# EAGLE design tritiled_v30_batt_pcb (EAGLE 8.2.2)
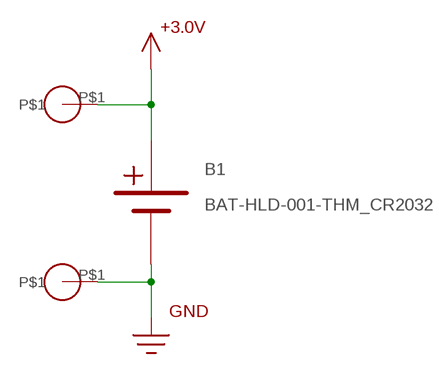
[diagram p0: schematic, sheet 1]

## Parts
B1  BAT-HLD-001-THM_CR2032  [CR2032_BAT-HLD-001-THM]
U$1  HDR_1_PIN  [HDR_1_PIN]
U$2  HDR_1_PIN  [HDR_1_PIN]

## Nets
+3.6V: B1.+V@1(+V) B1.+V@2(+V) B1.+V@3(+V) B1.+V@4(+V) U$1.P$1 ; supply symbol labelled +3.0V
GND: B1.GND(0V) U$2.P$1

## Library data of the parts
B1 = tritiled:BAT-HLD-001-THM_CR2032
U$1 U$2 = tritiled:HDR_1_PIN

## Board
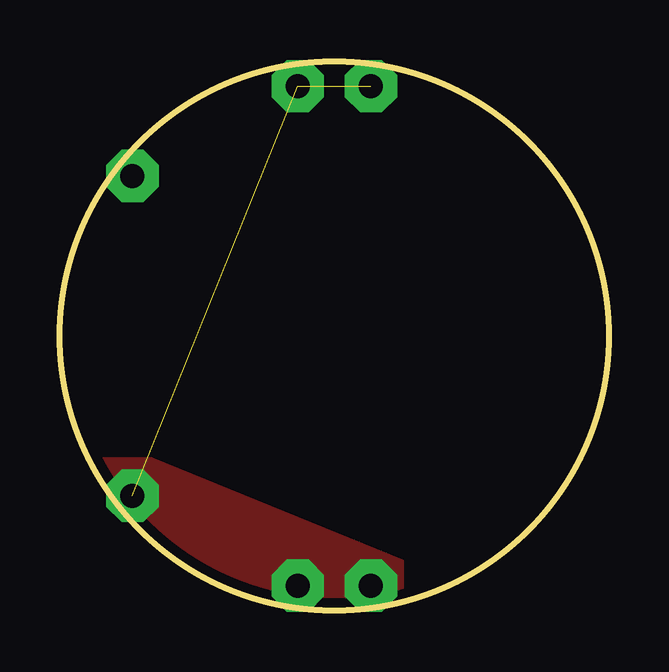
[diagram p1: board, top side]
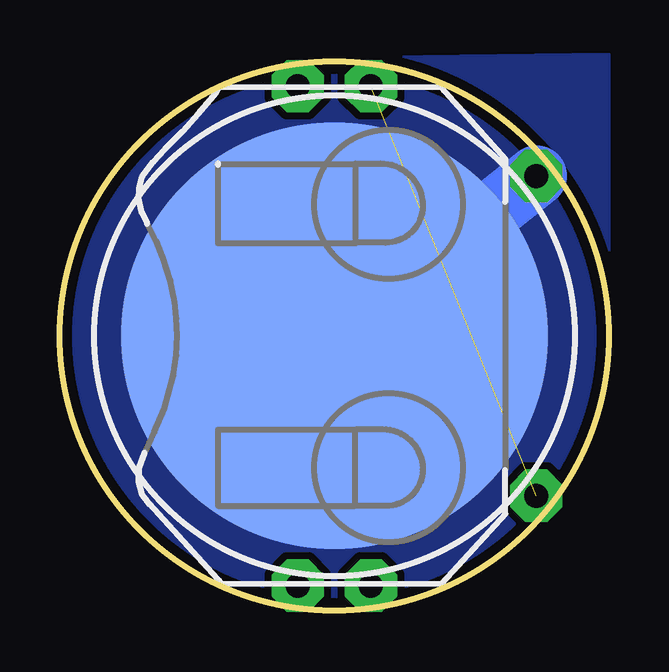
[diagram p2: board, bottom side, seen from below]

Size 22.86 x 22.86 mm. Coordinates in mm from the lower left corner, seen from the top.
Outline: circle at 11.43,11.43 radius 11.43
Copper layers (1*16): Top 0.0356mm / dielectric 1.5011mm / Bottom 0.0356mm
Design rules "LaenPCBOrder_tented_vias_12mil": minimum track width 8mil, minimum drill 13mil, track to track 12mil, track to pad 12mil, pad to pad 12mil, via to via 12mil, smd to smd 12mil, copper to edge 15mil, drill to drill 6mil, minimum pad ring 7mil, minimum via ring 7mil, stop-mask expansion 4mil, vias tented up to drill 28mil, thermal gap 10mil

### Footprints (pad centres in the part's own frame; a part is rotated, then mirrored left to right if it is on the bottom)
CR2032_BAT-HLD-001-THM = drill 1 pad 2.184 octagon: +V@1 -10.414,1.524; +V@2 -10.414,-1.524; +V@3 10.414,-1.524; +V@4 10.414,1.524 | smd 17.78 x 17.78: GND 0,0
HDR_1_PIN = drill 1 pad 2.184 octagon: P$1 0,0

### Placement (x,y rotation side)
B1  11.43,11.43 270 bottom
U$1  3.02,4.76 0 top
U$2  3.02,18.1 0 top

### Tracks (layer width: path | path; a pad name or v marks a point on that pad's centre or on a via)
+3.6V  (2 unrouted)
  pour Top (no thermals): 1.27,6.35 3.81,6.35 14.29,2.06 14.29,0.32 13.81,-0.16 6.19,-0.16 1.43,4.6
GND
  Bottom 2.54: U$2.P$1 B1.GND
  pour Bottom (no thermals): 0,0 0,23.18 23.18,22.86 23.18,-0.32